# Altium schematic sheet USBC_PD_PWR.SchDoc
size 736 x 304 mm; SheetNumber: 2; SheetTotal: 3
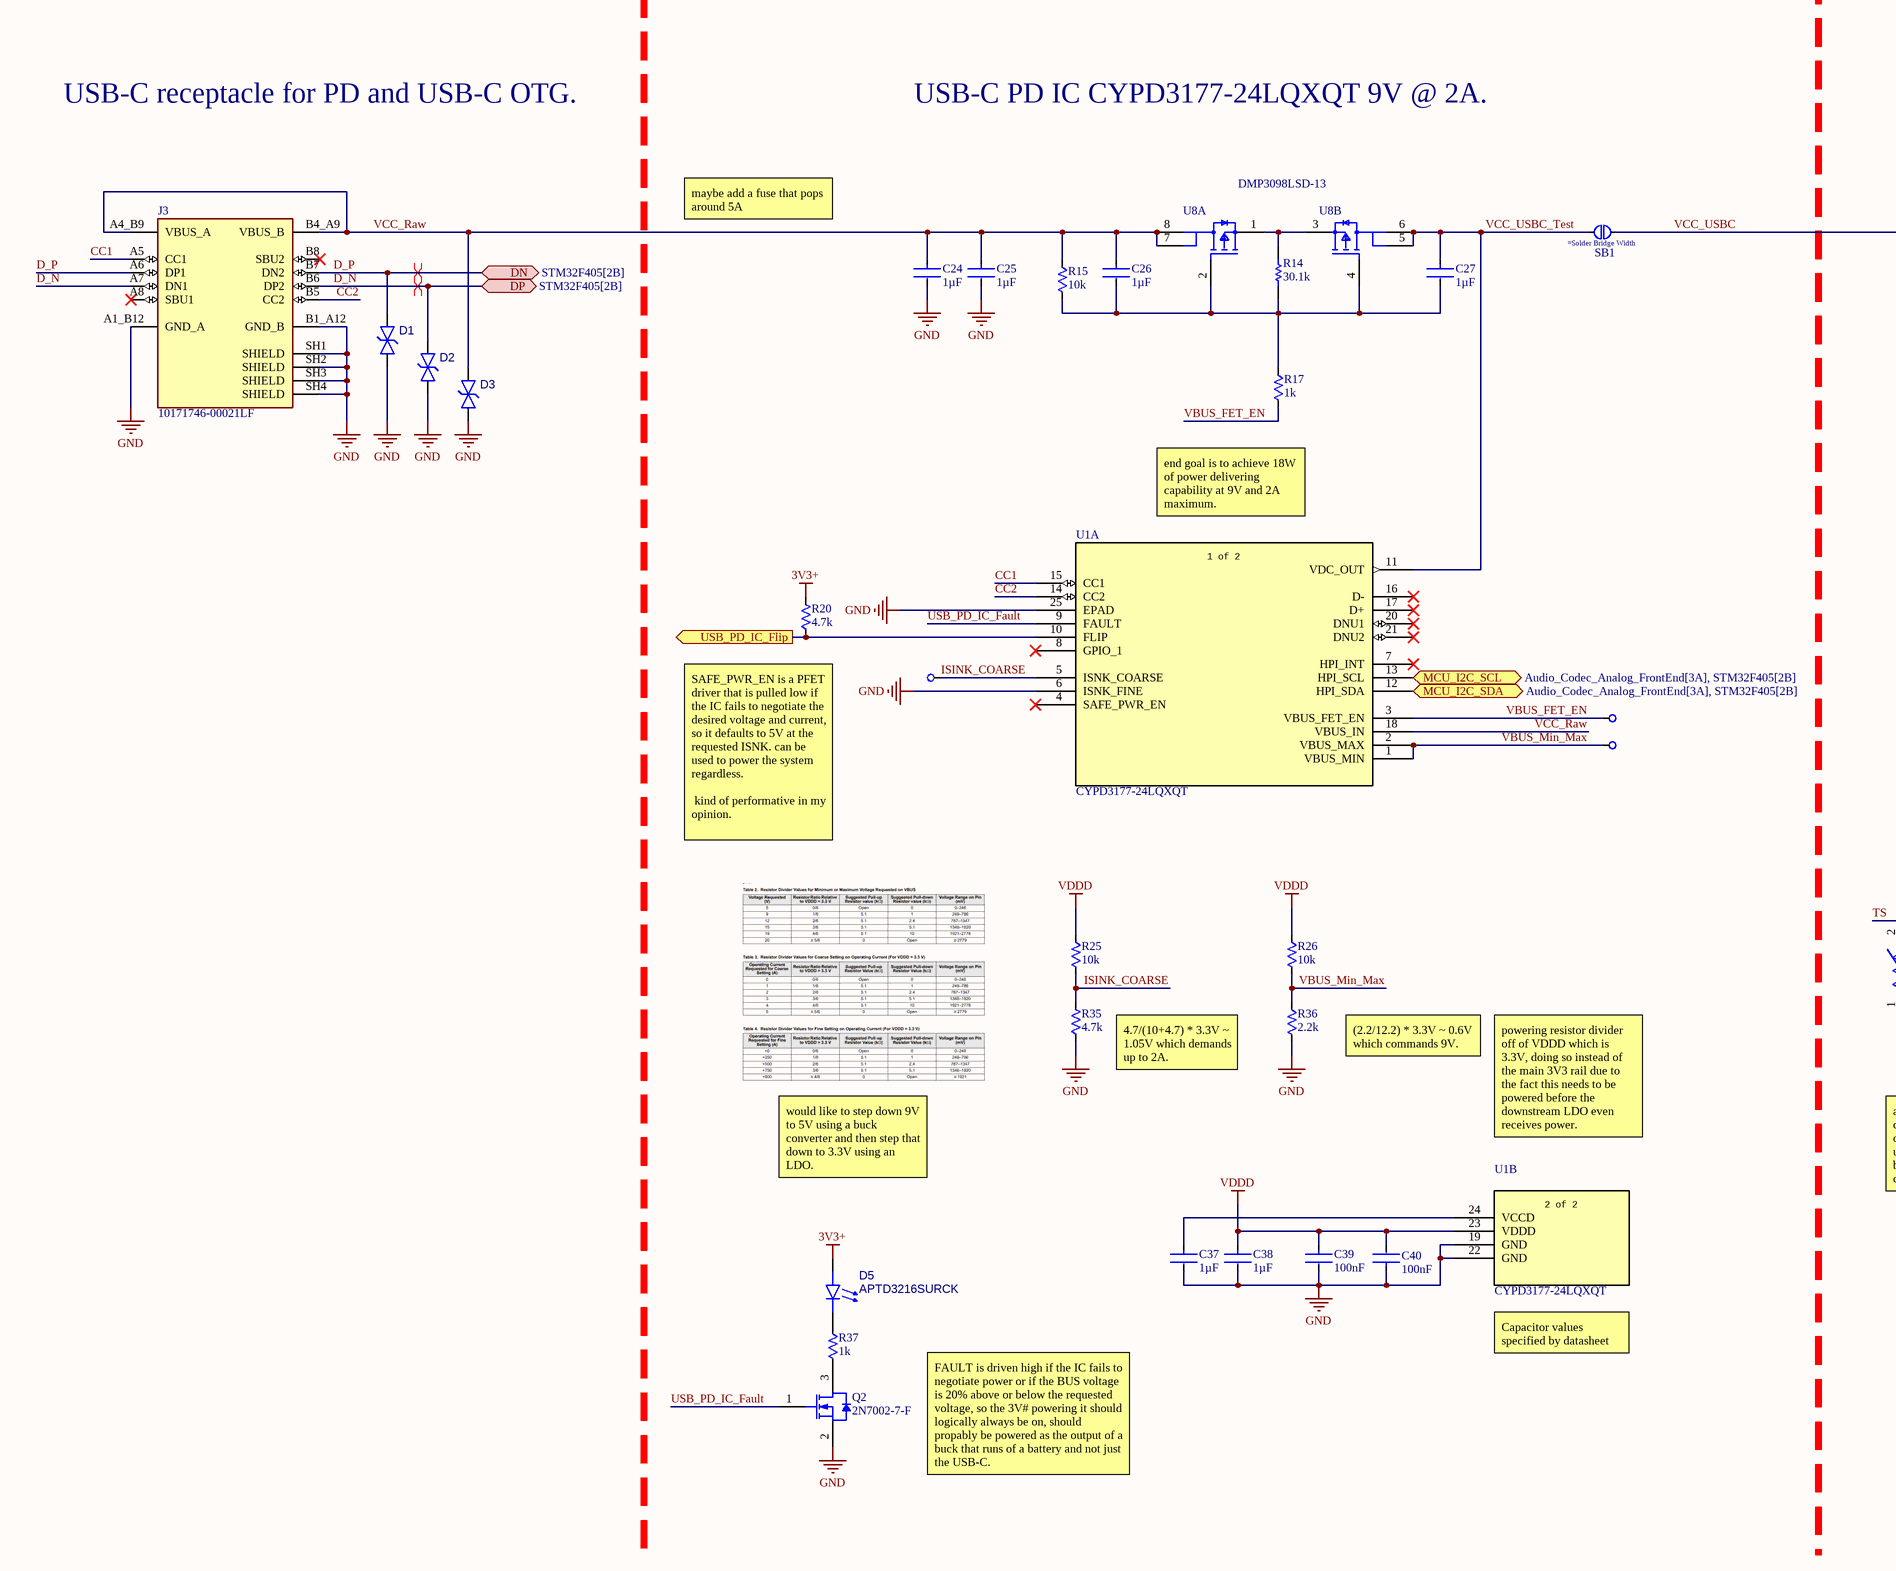
[diagram p0: USBC_PD_PWR.SchDoc, left]
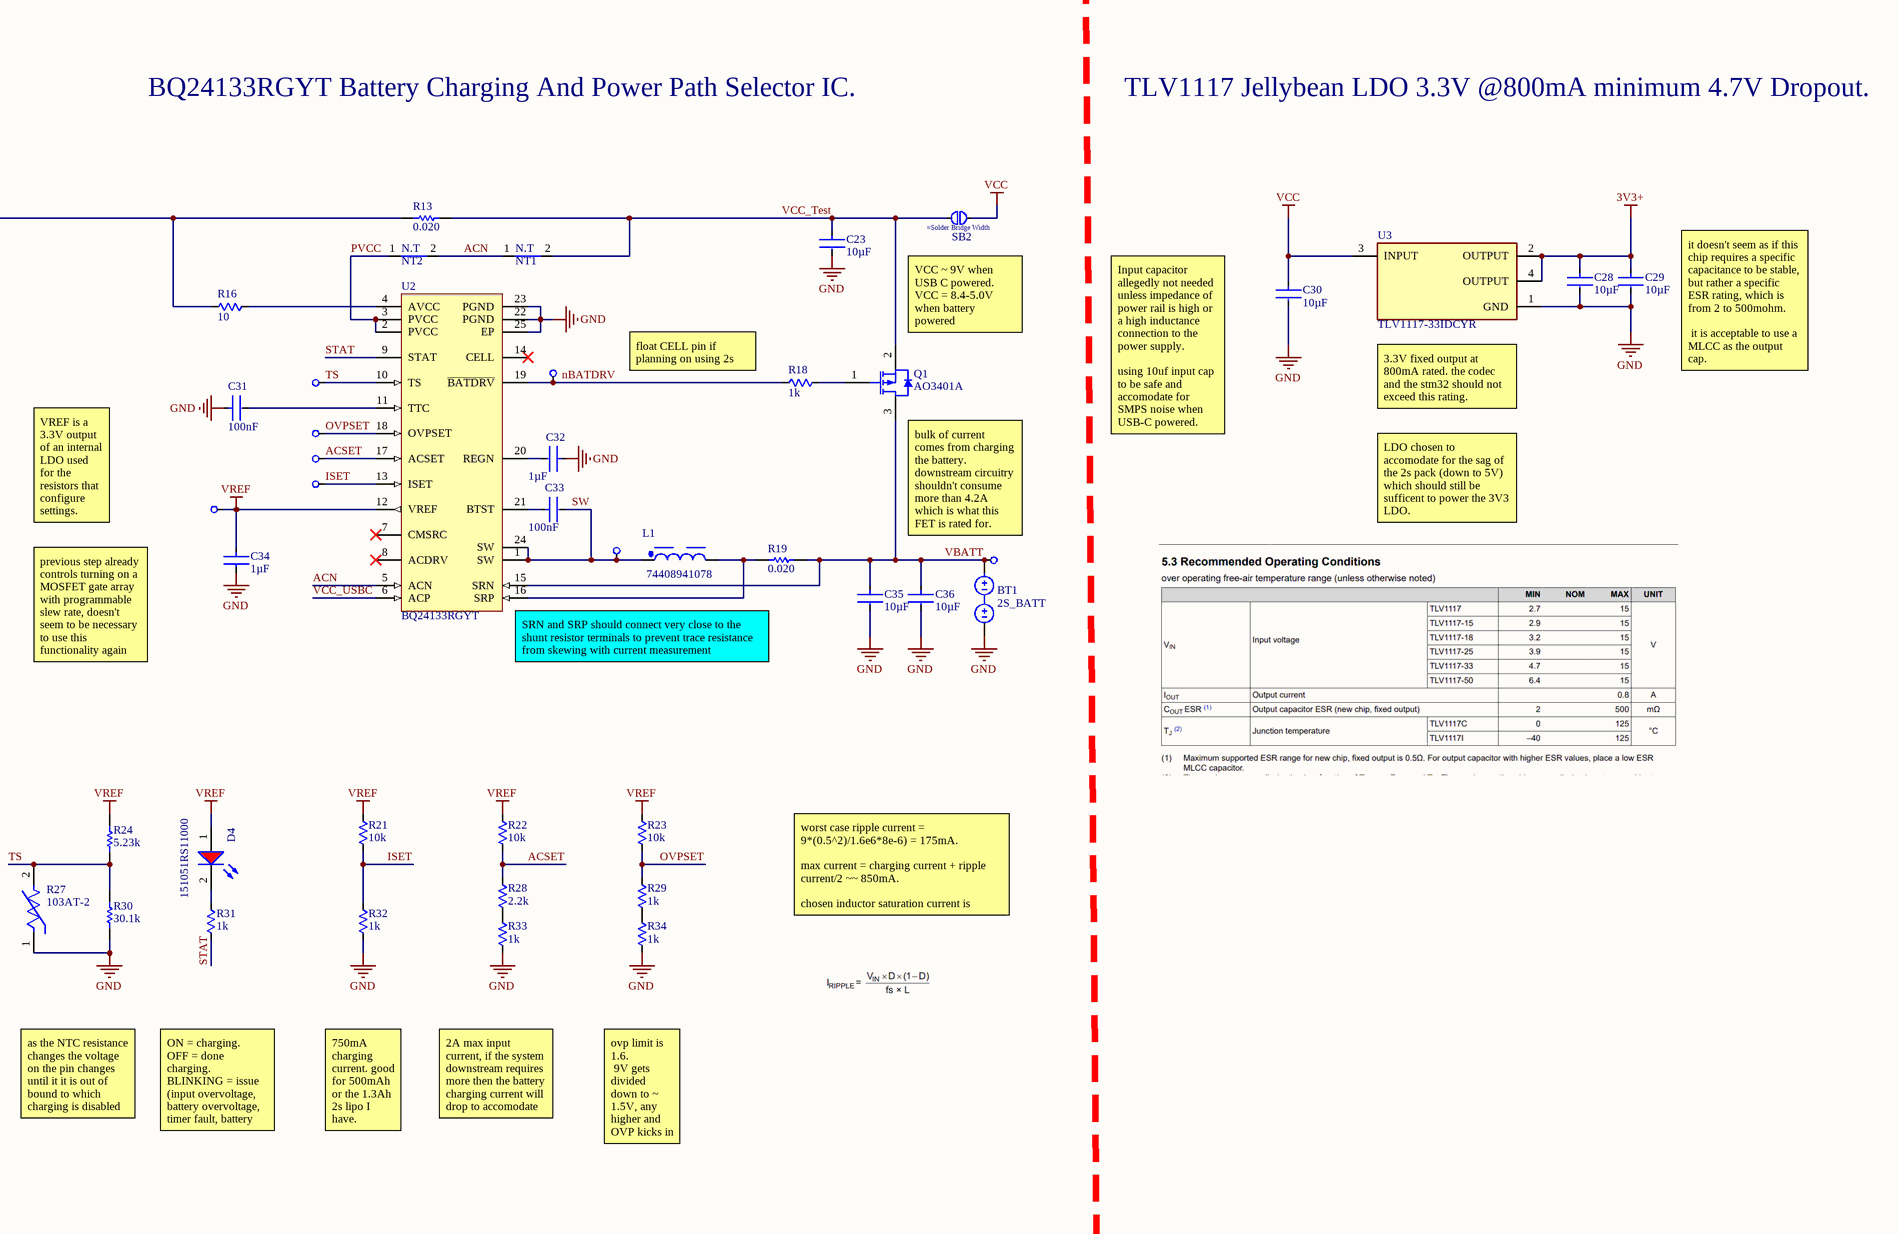
[diagram p1: USBC_PD_PWR.SchDoc, right]

## Parts
BT1  2S_BATT  [2_soldering_pads]
C23  value 10µF  [MURATA-G_M21B]  (hidden comment: GCM21BC71E106KE36L)
C24  value 1µF  [MURATA-G_M188]  (hidden comment: GCM188R71E105KA64D)
C25  value 1µF  [MURATA-G_M188]  (hidden comment: GCM188R71E105KA64D)
C26  value 1µF  [MURATA-G_M188]  (hidden comment: GCM188R71E105KA64D)
C27  value 1µF  [MURATA-G_M188]  (hidden comment: GCM188R71E105KA64D)
C28  value 10µF  [MURATA-G_M21B]  (hidden comment: GCM21BC71E106KE36L)
C29  value 10µF  [MURATA-G_M21B]  (hidden comment: GCM21BC71E106KE36L)
C30  value 10µF  [MURATA-G_M21B]  (hidden comment: GCM21BC71E106KE36L)
C31  value 100nF  [MURATA-G_M188]  (hidden comment: GCM188R71H104KA57D)
C32  value 1µF  [MURATA-G_M188]  (hidden comment: GCM188R71E105KA64D)
C33  value 100nF  [MURATA-G_M188]  (hidden comment: GCM188R71H104KA57D)
C34  value 1µF  [MURATA-G_M188]  (hidden comment: GCM188R71E105KA64D)
C35  value 10µF  [MURATA-G_M21B]  (hidden comment: GCM21BC71E106KE36L)
C36  value 10µF  [MURATA-G_M21B]  (hidden comment: GCM21BC71E106KE36L)
C37  value 1µF  [MURATA-G_M188]  (hidden comment: GCM188R71E105KA64D)
C38  value 1µF  [MURATA-G_M188]  (hidden comment: GCM188R71E105KA64D)
C39  value 100nF  [MURATA-G_M188]  (hidden comment: GCM188R71H104KA57D)
C40  value 100nF  [MURATA-G_M188]  (hidden comment: GCM188R71H104KA57D)
D1  SD12C.TCT  [SDXXC.TCT]  (value not drawn)
D2  SD12C.TCT  [SDXXC.TCT]  (value not drawn)
D3  SD12C.TCT  [SDXXC.TCT]  (value not drawn)
D4  151051RS11000  [WL-TMRC_D5.9H8.7]
D5  APTD3216SURCK  [APTD3216SURCK-Footprint-1]
J3  10171746-00021LF  [AMPHENOL_10171746-00021LF]
L1  74408941078  [WE-SPC_4818]
NT1  Net_Tie  [Net_Tie_150]  (value not drawn)  (net tie, no BOM)
NT2  Net_Tie  [Net_Tie_150]  (value not drawn)  (net tie, no BOM)
Q1  AO3401A  [AO-SOT-23-3L_V]
Q2  2N7002-7-F  [DIODESINC-SOT23]
R13  0.020  [RESC3216X70X50LL05T20]
R14  30.1k  [RESC0603(1608)_N]
R15  value 10k  [VISHAY-CRCW0603]  (hidden comment: CRCW060310K0FKTA)
R16  value 10  [FP-CRCW1206-e3-MFG]  (hidden comment: CRCW120610R0FKEAHP)
R17  value 1k  [VISHAY-TNPW0603]  (hidden comment: TNPW06031K00BEEA)
R18  value 1k  [VISHAY-TNPW0603]  (hidden comment: TNPW06031K00BEEA)
R19  0.020  [RESC3216X70X50LL05T20]
R20  value 4.7k  [VISHAY-CRCW0603]  (hidden comment: CRCW06034K70FKTA)
R21  value 10k  [VISHAY-CRCW0603]  (hidden comment: CRCW060310K0FKTA)
R22  value 10k  [VISHAY-CRCW0603]  (hidden comment: CRCW060310K0FKTA)
R23  value 10k  [VISHAY-CRCW0603]  (hidden comment: CRCW060310K0FKTA)
R24  5.23k  [RESC1608X55X30NL15T15]
R25  value 10k  [VISHAY-CRCW0603]  (hidden comment: CRCW060310K0FKTA)
R26  value 10k  [VISHAY-CRCW0603]  (hidden comment: CRCW060310K0FKTA)
R27  103AT-2  [FP-103AT-2-MFG]
R28  value 2.2k  [VISHAY-CRCW0603]  (hidden comment: CRCW06032K20FKTA)
R29  value 1k  [VISHAY-TNPW0603]  (hidden comment: TNPW06031K00BEEA)
R30  30.1k  [RESC0603(1608)_N]
R31  value 1k  [VISHAY-TNPW0603]  (hidden comment: TNPW06031K00BEEA)
R32  value 1k  [VISHAY-TNPW0603]  (hidden comment: TNPW06031K00BEEA)
R33  value 1k  [VISHAY-TNPW0603]  (hidden comment: TNPW06031K00BEEA)
R34  value 1k  [VISHAY-TNPW0603]  (hidden comment: TNPW06031K00BEEA)
R35  value 4.7k  [VISHAY-CRCW0603]  (hidden comment: CRCW06034K70FKTA)
R36  value 2.2k  [VISHAY-CRCW0603]  (hidden comment: CRCW06032K20FKTA)
R37  value 1k  [VISHAY-TNPW0603]  (hidden comment: TNPW06031K00BEEA)
SB1  SOLDER_BRIDGE  [SOLDER_BRIDGE_60MIL]  (value not drawn)  (net tie, no BOM)
SB2  SOLDER_BRIDGE  [SOLDER_BRIDGE_60MIL]  (value not drawn)  (net tie, no BOM)
TP14  Testpoint 1mm  [Testpoint 1mm]  (value not drawn)
TP15  Testpoint 1mm  [Testpoint 1mm]  (value not drawn)
TP16  Testpoint 1mm  [Testpoint 1mm]  (value not drawn)
TP17  Testpoint 1mm  [Testpoint 1mm]  (value not drawn)
TP18  Testpoint 1mm  [Testpoint 1mm]  (value not drawn)
TP19  Testpoint 1mm  [Testpoint 1mm]  (value not drawn)
TP20  Testpoint 1mm  [Testpoint 1mm]  (value not drawn)
TP21  Testpoint 1mm  [Testpoint 1mm]  (value not drawn)
TP22  Testpoint 1mm  [Testpoint 1mm]  (value not drawn)
TP23  Testpoint 1mm  [Testpoint 1mm]  (value not drawn)
TP24  Testpoint 1mm  [Testpoint 1mm]  (value not drawn)
U1  CYPD3177-24LQXQT  [QFN24_CYPD3177-24LQXQT_INF]  (parts A,B of 2)
U2  BQ24133RGYT  [RGY0024A_V]
U3  TLV1117-33IDCYR  [FP-DCY0004A-MFG]
U8  DMP3098LSD-13  [SOP_DMP3098LSD-13_DIO]  (parts A,B of 2)

## Ports
DN (bidir, see STM32F405[2B]), DP (bidir, see STM32F405[2B]), MCU_I2C_SCL (bidir, see Audio_Codec_Analog_FrontEnd[3A], STM32F405[2B]), MCU_I2C_SDA (bidir, see Audio_Codec_Analog_FrontEnd[3A], STM32F405[2B]), USB_PD_IC_Flip (out)

## Nets
3V3+: C28.1 C29.1 D5.2(A) R20.1 U3.2(OUTPUT) U3.4(OUTPUT)
GND: BT1.2 C23.2 C24.2 C25.2 C28.2 C29.2 C30.2 C31.1 C32.1 C34.2 C35.2 C36.2 C37.2 C38.2 C39.2 C40.1 D1.1(A) D2.1(A) D3.1(A) J3.A1_B12(GND_A) J3.B1_A12(GND_B) J3.SH1(SHIELD) J3.SH2(SHIELD) J3.SH3(SHIELD) J3.SH4(SHIELD) Q2.2(S) R27.1 R30.1 R32.1 R33.1 R34.1 R35.2 R36.1 U1.6(ISNK_FINE) U1.19(GND) U1.22(GND) U1.25(EPAD) U2.22(PGND) U2.23(PGND) U2.25(EP) U3.1(GND)
VCC: C30.1 SB2.2 U3.3(INPUT)
VDDD: C38.1 C39.1 C40.2 R25.2 R26.2 U1.23(VDDD)
VREF: C34.1 D4.1(A) R21.2 R22.2 R23.2 R24.2 TP19.1 U2.12(VREF)
ACN: NT1.1 NT2.2 U2.5(ACN)
ACSET: R22.1 R28.2 TP17.1 U2.17(ACSET)
CC1: J3.A5(CC1) U1.15(CC1)
CC2: J3.B5(CC2) U1.14(CC2)
D_N: D2.2(A) J3.A7(DN1) J3.B6(DP2) ; port DP
D_P: D1.2(A) J3.A6(DP1) J3.B7(DN2) ; port DN
ISET: R21.1 R32.2 TP18.1 U2.13(ISET)
ISINK_COARSE: R25.1 R35.1 TP22.1 U1.5(ISNK_COARSE)
MCU_I2C_SCL: U1.13(HPI_SCL) ; port MCU_I2C_SCL
MCU_I2C_SDA: U1.12(HPI_SDA) ; port MCU_I2C_SDA
nBATDRV: R18.2 TP14.1 U2.19(~{BATDRV})
OVPSET: R23.1 R29.2 TP16.1 U2.18(OVPSET)
PVCC: NT2.1 U2.2(PVCC) U2.3(PVCC)
STAT: R31.1 U2.9(STAT)
SW: C33.2 L1.1 TP20.1 U2.1(SW) U2.24(SW)
TS: R24.1 R27.2 R30.2 TP15.1 U2.10(TS)
USB_PD_IC_Fault: Q2.1(G) U1.9(FAULT)
USB_PD_IC_Flip: R20.2 U1.10(FLIP) ; port USB_PD_IC_Flip
VBATT: BT1.1 C35.1 C36.1 Q1.3(DRAIN) R19.2 TP21.1 U2.15(SRN)
VBUS_FET_EN: R17.1 TP23.1 U1.3(VBUS_FET_EN)
VBUS_Min_Max: R26.1 R36.2 TP24.1 U1.1(VBUS_MIN) U1.2(VBUS_MAX)
VCC_Raw: C24.1 C25.1 C26.1 D3.2(A) J3.A4_B9(VBUS_A) J3.B4_A9(VBUS_B) R15.2 U1.18(VBUS_IN) U8.7(D1) U8.8(D1)
VCC_Test: C23.1 NT1.2 Q1.2(SOURCE) R13.2 SB2.1
VCC_USBC: R13.1 R16.1 SB1.2 U2.6(ACP)
VCC_USBC_Test: C27.1 SB1.1 U1.11(VDC_OUT) U8.5(D2) U8.6(D2)
NetC26_2: C26.2 C27.2 R14.1 R15.1 R17.2 U8.2(G1) U8.4(G2)
NetC31_2: C31.2 U2.11(TTC)
NetC32_2: C32.2 U2.20(REGN)
NetC33_1: C33.1 U2.21(BTST)
NetC37_1: C37.1 U1.24(VCCD)
NetD4_2: D4.2(K) R31.2
NetD5_1: D5.1(K) R37.2
NetL1_2: L1.2 R19.1 U2.16(SRP)
NetQ1_1: Q1.1(GATE) R18.1
NetQ2_3: Q2.3(D) R37.1
NetR14_2: R14.2 U8.1(S1) U8.3(S2)
NetR16_2: R16.2 U2.4(AVCC)
NetR28_1: R28.1 R33.2
NetR29_1: R29.1 R34.2

Not connected (* = marked no-connect by the designer): J3 A8(SBU1)* B8(SBU2)*; U1 4(SAFE_PWR_EN)* 7(HPI_INT)* 8(GPIO_1)* 16(D-)* 17(D+)* 20(DNU1)* 21(DNU2)*; U2 7(CMSRC)* 8(ACDRV)* 14(CELL)*

## Layout directives
differential pair: D_N, D_P

## Notes on the sheet
- USB-C receptacle for PD and USB-C OTG.
- USB-C PD IC CYPD3177-24LQXQT 9V @ 2A.
- BQ24133RGYT Battery Charging And Power Path Selector IC.
- TLV1117 Jellybean LDO 3.3V @800mA minimum 4.7V Dropout.
- maybe add a fuse that pops around 5A
- (near R18) float CELL pin if planning on using 2s battery
- VCC ~ 9V when USB C powered.
  VCC = 8.4-5.0V when battery powered
- it doesn't seem as if this chip requires a specific capacitance to be stable, but rather a specific ESR rating, which is from 2 to 500mohm.
  it is acceptable to use a MLCC as the output cap.
- Input capacitor allegedly not needed unless impedance of  power rail is high or a high inductance connection to the power supply.
  using 10uf input cap to be safe and accomodate for SMPS noise when USB-C powered.
- (near U3) 3.3V fixed output at 800mA rated. the codec and the stm32 should not exceed this rating.
- end goal is to achieve 18W of power delivering capability at 9V and 2A maximum.
- VREF is a 3.3V output of an internal LDO used for the resistors that configure settings.
- bulk of current comes from charging the battery.
  downstream circuitry shouldn't consume more than 4.2A which is what this FET is rated for.
- LDO chosen to accomodate for the sag of the 2s pack (down to 5V) which should still be sufficent to power the 3V3 LDO.
- previous step already controls turning on a MOSFET gate array with programmable slew rate, doesn't seem to be necessary to use this functionality again
- (near U2) SRN and SRP should connect very close to the shunt resistor terminals to prevent trace resistance from skewing with current measurement
- (near R20) SAFE_PWR_EN is a PFET driver that is pulled low if the IC fails to negotiate the desired voltage and current, so it defaults to 5V at the requested ISNK. can be used to power the system regardless.
  kind of performative in my opinion.
- worst case ripple current = 9*(0.5^2)/1.6e6*8e-6) = 175mA.
  max current = charging current + ripple current/2 ~~ 850mA.
  chosen inductor saturation current is 1.95A.
- 4.7/(10+4.7) * 3.3V ~ 1.05V which demands up to 2A.
- (2.2/12.2) * 3.3V ~ 0.6V which commands 9V.
- powering resistor divider off of VDDD which is 3.3V, doing so instead of the main 3V3 rail due to the fact this needs to be powered before the downstream LDO even receives power.
- would like to step down 9V to 5V using a buck converter and then step that down to 3.3V using an LDO.
- as the NTC resistance changes the voltage on the pin changes until it it is out of bound to which charging is disabled
- ON = charging.
  OFF = done charging.
  BLINKING = issue (input overvoltage, battery overvoltage, timer fault, battery absent).
- 750mA charging current. good for 500mAh or the 1.3Ah 2s lipo I have.
- 2A max input current, if the system downstream requires more then the battery charging current will drop to accomodate
- ovp limit is 1.6.
  9V gets divided down to ~ 1.5V, any higher and OVP kicks in
- Capacitor values specified by datasheet
- FAULT is driven high if the IC fails to negotiate power or if the BUS voltage is 20% above or below the requested voltage, so the 3V# powering it should logically always be on, should propably be powered as the output of a buck that runs of a battery and not just the USB-C.
- (in symbol CYPD3177-24LQXQT, part A) 1 of 2
- (in symbol CYPD3177-24LQXQT, part B) 2 of 2
- (in symbol Net_Tie) N.T

## Library data of the parts
C23 C28-C30 C35 C36 = CMP-001-02049-3: 10 µF ±10% 25V Ceramic Capacitor X7S 0805 (2012 Metric); Capacitor Type: Ceramic; Mounting Technology: Surface Mount; Min Operating Temperature: 125°C; Case/Package: 0805; Voltage Rating: 25V; Temperature Code: X7S; Tolerance: 10%; Pins: 2; Max Operating Temperature: -55°C
C24-C27 C32 C34 C37 C38 = CMP-001-00230-4: 1 µF ±10% 25V Ceramic Capacitor X7R 0603 (1608 Metric); Tolerance: 10%; Mounting Technology: Surface Mount; Temperature Code: X7R; Case/Package: 0603; RoHS Compliant: Yes; Pins: 2; Capacitor Type: Ceramic; Voltage Rating: 25V
C31 C33 C39 C40 = CMP-001-00243-4: 0.1 µF ±10% 50V Ceramic Capacitor X7R 0603 (1608 Metric); Pins: 2; Temperature Code: X7R; Mounting Technology: Surface Mount; Capacitor Type: Ceramic; Case/Package: 0603; RoHS Compliant: Yes; Tolerance: 10%; Voltage Rating: 50V
D1-D3 = CMP-004-00052-2: 24V Clamp 15A (8/20µs) Ipp Tvs Diode Surface Mount SOD-323; Min Operating Temperature: -55°C; Pins: 2; Mounting Technology: Surface Mount; Max Operating Temperature: 125°C
D4 = CMP-1488-00008-3: WL-TMRC Red Color Diffused 5 mm Round Through Hole LED; Manufacturer Lifecycle Status: ACTIVE; Forward Voltage: 2.1V; YEOL: 1 = Estimated lifetime > 10 years; Lens Size: 5mm; Lens Style: Circular, Diffused, Round; Luminous Intensity: 30mcd; Test Current: 20mA; Viewing Angle: 60°; Wavelength: 630nm; Max Reverse Voltage (DC): 5V; Forward Current: 100mA; Dominant Wavelength: 645nm; Peak Wavelength: 650nm; Height: 8.6mm; REACH SVHC: Unknown; Width: 5mm; RoHS: Compliant; Mount: Through Hole; Case/Package: Radial; Min Operating Temperature: -40°C; Length: 5mm; Max Operating Temperature: 85°C; Packaging: Bulk; Color: Red; Lifecycle Status: Production
D5 = CMP-007-00000-1: Single Color LED, Hyper Red, Water Clear, 1.6mm; Forward Current: 30mA; Forward Voltage: 2.5V; Mounting Technology: Surface Mount; Max Operating Temperature: 85°C; Pins: 2; Min Operating Temperature: -40°C; RoHS Compliant: Yes
J3 = CMP-002-00084-1: USB-C (USB TYPE-C) USB 2.0 Receptacle Connector 24 (6+18 Dummy) Position Surface Mount, Right Angle; Through Hole; MF: Amphenol; MP: 10171746-00021LF; Design Item ID: 10171746-00021LF; Component Type: Standard; Case/Package: None; Pins: 16; Check_prices: https://www.snapeda.com/parts/10171746-00021LF/Amphenol/view-part/?ref=eda; Value: *; Source: 10171746-00021LF.SchLib; SnapEDA_Link: https://www.snapeda.com/parts/10171746-00021LF/Amphenol/view-part/?ref=snap
L1 = CMP-1401-00004-3: WE-SPC SMT Shielded Power Inductor; Inductance Tolerance: 20%; DC Resistance (DCR): 195mΩ; Current Rating: 1.05A; Inductance: 7.8µH; Self Resonant Frequency: 35MHz; Core Material: Ferrite; Ambient Temperature Range Low: -40°C; Ambient Temperature Range High: 85°C; Max Operating Temperature: 125°C; Number of Pins: 2; Length: 4.8mm; Min Operating Temperature: -40°C; Width: 4.8mm; Height: 1.8mm; RoHS: Compliant
Q1 = CMP-2000-05778-1: P-Channel MOSFET, 30 V, 4 A, -55 to 150 degC, 3-Pin SOT-23-3L, RoHS, Tape and Reel; Manufacturer: Alpha and Omega; Output Power (Max): NotRequiredW; Power Dissipation: 1.4W; Rad Hardened: No; Drain Efficiency: NotRequired%; Drain-Source On-Volt: 30V; Noise Figure: NotRequireddB; Frequency (Max): NotRequiredMHz; Number of  Elements: 1; Gate-Source Voltage (Max): ?12V; Drain Current (Max): 4A; Channel Mode: Enhancement; Drain-Source On-Res: 0.044ohm; Type: PowerMOSFET; Polarity: P; Package URL: http://www.aosmd.com/res/packaging_information/SOT-23-3L.pdf; Datasheet URL: http://www.aosmd.com/res/data_sheets/AO3401A.pdf; Package Type: SOT-23; Package Description: 3-Pin Small Outline Transistor, Body 2.95 x 1.6 mm, Pitch 0.95 mm; Mounting: SurfaceMount; Manufacturer URL: http://www.aosmd.com/; Continuous Drain Current: 4A; Package Reference: SOT-23-3L; Mounting Technology: SurfaceMount; Operating Temperature Classification: Military; Power Gain: NotRequireddB; Datasheet Version: Rev. 3, 03/2011; Operating Temp Range: -55Cto150C; Pin Count: 3
Q2 = CMP-013-00013-4: N-Channel 60 V 115mA (Ta) 370mW (Ta) Surface Mount SOT-23-3; RoHS Compliant: Yes; Max Operating Temperature: 150°C; Case/Package: SOT-23; Pins: 3
R13 R19 = CMP-2003-00793-1: Manufacturer: Panasonic; Part Number: ERJ8CWFR020V
R14 R30 = CMP-1012-00676-1: 30K1 0.1W 1% 0603 (1608 Metric)  SMD; Case-Metric: 1608; Case-EIA: 0603; Value: 30100.00 Ohm; Tolerance: 1 %; Power: 0.1 W; Technology: SMT
R15 R21-R23 R25 R26 = CMP-009-00002-7: 10 kOhms ±1% 0.1W, 1/10W Chip Resistor 0603 (1608 Metric) Automotive AEC-Q200 Thick Film; Power: 100mW; Voltage Rating: 75V; Max Operating Temperature: 155°C; Pins: 2; Min Operating Temperature: -55°C; RoHS Compliant: No; Tolerance: 1%; Case/Package: 0603; Mounting Technology: Surface Mount
R16 = CMP-009-00281-1: RES SMD 10 OHM 1% 3/4W 1206; Voltage Rating: 200V; Power: 750mW; Max Operating Temperature: 155°C; Case/Package: 1206; Min Operating Temperature: -55°C; Mounting Technology: Surface Mount; Tolerance: 1%; Pins: 2
R17 R18 R29 R31-R34 R37 = CMP-009-00212-3: 1 kOhms ±0.1% 0.21W Chip Resistor 0603 (1608 Metric) Anti-Sulfur, Automotive AEC-Q200, Moisture Resistant Thin Film; Voltage Rating: 100V; Power: 100mW; Pins: 2; Mounting Technology: Surface Mount; Tolerance: 0.1%; Case/Package: 0603; Max Operating Temperature: 125°C; RoHS Compliant: Yes; Min Operating Temperature: -55°C
R20 R35 = CMP-009-00003-6: 4.7 kOhms ±1% 0.1W, 1/10W Chip Resistor 0603 (1608 Metric) Automotive AEC-Q200 Thick Film; Power: 100mW; Voltage Rating: 75V; RoHS Compliant: No; Pins: 2; Min Operating Temperature: -55°C; Case/Package: 0603; Max Operating Temperature: 155°C; Mounting Technology: Surface Mount; Tolerance: 1%
R24 = CMP-2000-00550-1: Manufacturer: Panasonic; Part Number: ERJ-3EKF5231V
R27 = CMP-2000-05824-2: Thermistor NTC 10KOhm 1% 2-Pin; Resistance: 10kR; Lead Pitch: 2.54mm; Height: 2.4mm; Max Operating Temperature: 110°C; Width: 3.7mm; RoHS Compliant: Yes; Min Operating Temperature: -50°C; Termination: Radial; Packaging: Bulk; Number of Pins: 2; Series: AT; Tolerance: 1%; Length: 17mm
R28 R36 = CMP-009-00147-4: 2.2 kOhms ±1% 0.1W, 1/10W Chip Resistor 0603 (1608 Metric) Automotive AEC-Q200 Thick Film; Voltage Rating: 75V; Power: 100mW; Min Operating Temperature: -55°C; Tolerance: 1%; Mounting Technology: Surface Mount; Pins: 2; Max Operating Temperature: 155°C; Case/Package: 0603; RoHS Compliant: No
SB1 SB2 = CMP-00030-00002-6: Various 2-pad solder bridge footprints; Pins: 2
TP14-TP24 = CMP-00030-00004-4: Labelled 1mm testpoint pad
U1 = CYPD3177-24LQXQT: EZ-PDâ„¢ Barrel Connector Replacement (BCR) CYPD3177-24LQXQT is the tape and reel packing type option of EZ-PDâ„¢ BCR family, the highly-integrated USB Type-C port controllers for power sink applications. It targets electronic devices using legacy barrel connectors up to 100 W or USB micro-B for power inputs, enabling product designers to replace these incompatible connectors with USB-C.EZ-PDâ„¢ BCR complies with USB Type-C and USB 3.0 Power Delivery (PD) standards and enables users to quickly convert their devices from being powered through a barrel connector to being powered via the USB-C connector with few external components and no firmware development is required. It integrates a complete USB Type-C transceiver, USB PD policy manager, a load switch controller with a soft start, all termination resistors required for a USB Type-C port, and system-level ESD protection. It is available in a 24-pin QFN package.; Manufacturer_Name: Infineon; Copyright: Copyright (C) 2026 Ultra Librarian. All rights reserved.; Manufacturer_Part_Number: CYPD3177-24LQXQT; RefDes: RefDes; Type: Type
U2 = CMP-0321-00108-2: Synchronous Switch-Mode Li-Ion and Li-Polymer Stand-Alone Battery Charger, -40 to 85 degC, 24-pin VQFN (RGY), Green (RoHS & no Sb/Br); Manufacturer: Texas Instruments; Li-Polymer: N; SubFamily: Battery Charge Management; ComponentLink1URL: http://www.ti.com/general/docs/lit/getliterature.tsp?genericPartNumber=BQ24133&fileType=pdf; Over Voltage Protection: N; Code_JEDEC: MO-241-BA; Li-Ion: N; ComponentLink1Description: Datasheet; NiCd: N; NiMH: N; Lead Acid: N; PackageDescription: 24-Leads Plastic Quad Flatpack No-Lead, 5.5 x 3.5 x 0.9 mm Body, 0.5 mm Pitch, Exposed Pad; PackageVersion: revI, Jun-2011; Mounting Technology: Surface Mount; PartNumber: BQ24133RGYT; Eco-Plan: Green (RoHS & no Sb/Br); DatasheetVersion: SLUSAF7B; PackageReference: RGY0024A
U3 = CMP-04917-000056-1: IC REG LIN 3.3V 800MA SOT223-4; Manufacturer: Texas Instruments; Nominal Supply Current: 5mA; Dropout Voltage: 1.2V; Max Supply Voltage: 15V; Min Supply Voltage: 4.7V; Output Type: Fixed; Number Of Outputs: 1; Output Current: 0.8A; Standoff Height: 0.02mm; Max Junction Temp: +125°C; Lead Free: Yes; RoHS: TRUE; Temperature: -40°C to +125°C; Device Class L1: Integrated Circuits (ICs); Output Voltage: 3.3V; Device Class L3: Voltage Regulators - Linear; Octopart: https://octopart.com/tlv1117-33idcyr-texas+instruments-669250; Device Class L2: Power Management ICs; Package: DCY0004A; Temperature Range High: +125°C; Category: IC; Height: 1.8mm; Automotive: No; Digikey Description: IC REG LIN 3.3V 800MA SOT223-4; Temperature Range Low: -40°C; ComponentLink2URL: http://www.ti.com/lit/ds/symlink/tlv1117.pdf; ComponentLink2Description: Datasheet; Manufacturer Part Number: TLV1117-33IDCYR; Mouser Description: LDO Voltage Regulators Fixed LDO Volt Reg
U8 = DMP3098LSD-13: Description; Manufacturer_Name: Diodes Inc; Copyright: Copyright (C) 2025 Ultra Librarian. All rights reserved.; Manufacturer_Part_Number: DMP3098LSD-13; RefDes: RefDes; Type: Type